# EAGLE design trinket_power_sensing_backback (EAGLE 7.7.0)
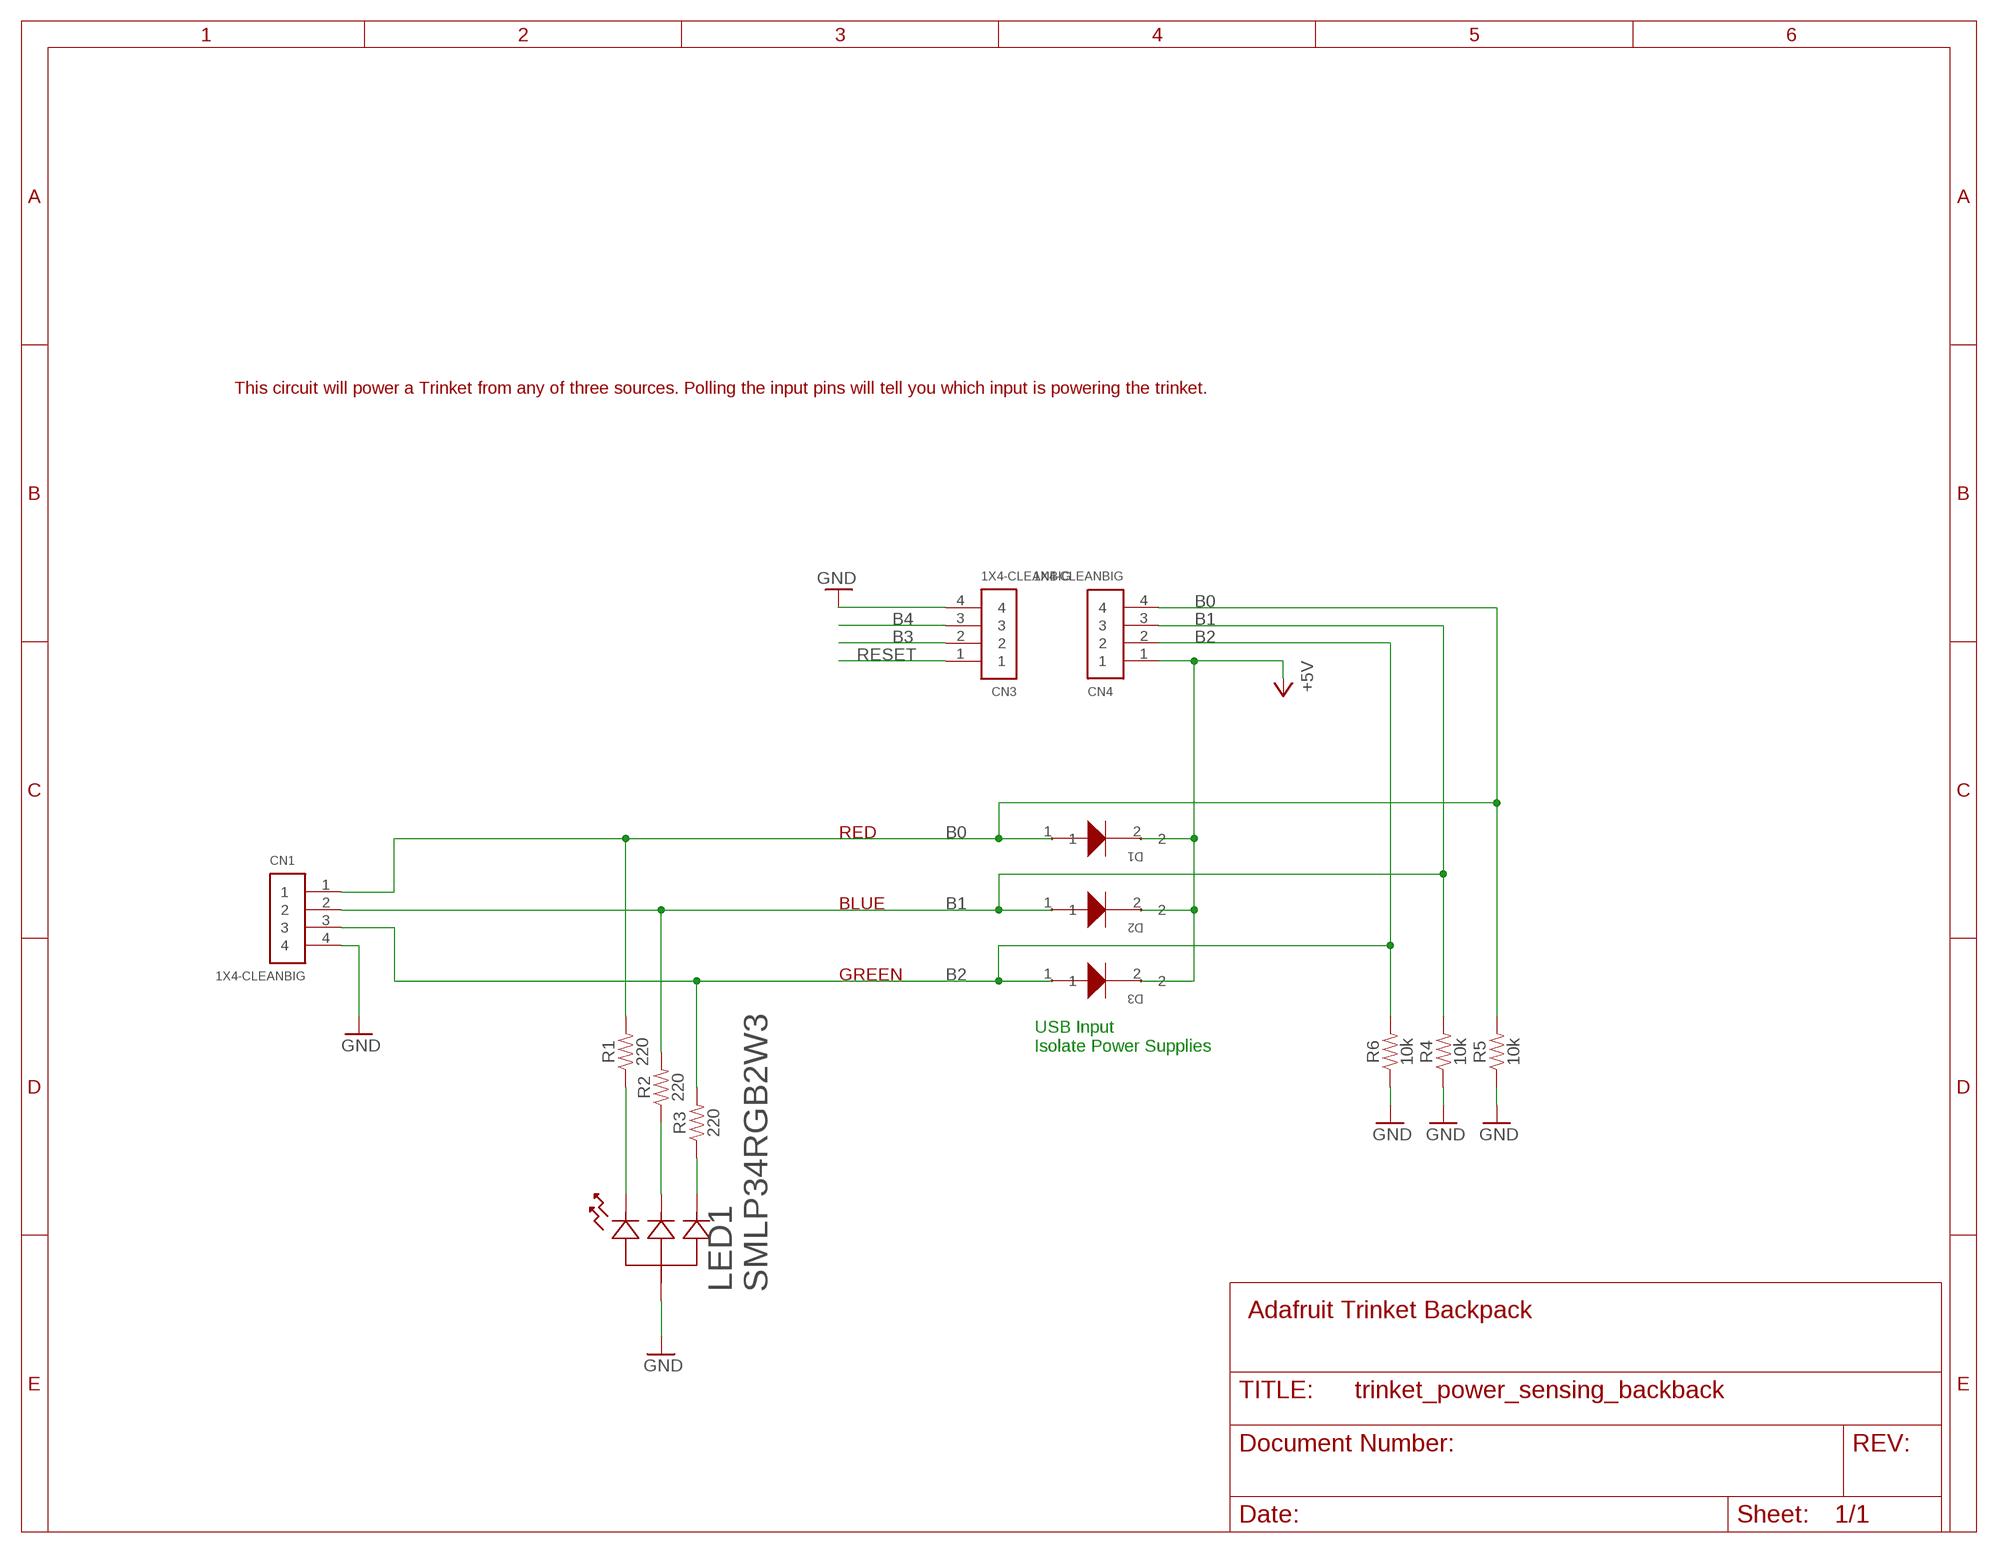
[diagram p0: schematic, sheet 1]

## Parts
CN1  1X4-CLEANBIG  [1X04-CLEANBIG]
CN3  1X4-CLEANBIG  [1X04-CLEANBIG]
CN4  1X4-CLEANBIG  [1X04-CLEANBIG]
D1  CMF04(TE12L,Q,M)  [M-FLAT_TOS]
D2  CMF04(TE12L,Q,M)  [M-FLAT_TOS]
D3  CMF04(TE12L,Q,M)  [M-FLAT_TOS]
LED1  SMLP34RGB2W3  [LED_SML-P24M_ROM]
R1  220  220OHM-0603-1/10W-1%  [0603]
R2  220  220OHM-0603-1/10W-1%  [0603]
R3  220  220OHM-0603-1/10W-1%  [0603]
R4  10k  220OHM-0603-1/10W-1%  [0603]
R5  10k  220OHM-0603-1/10W-1%  [0603]
R6  10k  220OHM-0603-1/10W-1%  [0603]

## Nets
+5V: CN4.1 D1.2 D2.2 D3.2
B0: CN1.1 CN4.4 D1.1 R1.2 R5.2
B1: CN1.2 CN4.3 D2.1 R2.2 R4.2
B2: CN1.3 CN4.2 D3.1 R3.2 R6.2
B3: CN3.2
B4: CN3.3
GND: CN1.4 CN3.4 LED1.1 R4.1 R5.1 R6.1
N$1: LED1.2 R1.1
N$2: LED1.3 R2.1
N$3: LED1.4 R3.1
RESET: CN3.1

## Notes on the sheet
- This circuit will power a Trinket from any of three sources. Polling the input pins will tell you which input is powering the trinket.
- RED
- BLUE
- GREEN
- USB Input
  Isolate Power Supplies
- Adafruit Trinket Backpack

## Library data of the parts
CN1 CN3 CN4 = adafruit:1X4: 4-pin connector
D1-D3 = CMF04(TE12L,Q):CMF04(TE12L,Q,M); BUILT_BY: EMA_UL_Team; COPYRIGHT: Copyright (C) 2018 Accelerated Designs. All rights reserved; MANUFACTURER_PART_NUMBER: CMF04(TE12L,Q,M); SOURCELIBRARY: Toshiba_2019-12-10; VENDOR: Toshiba
LED1 = SMLP34RGB2W3A:SMLP34RGB2W3; BUILT_BY: EMA_Matt; COPYRIGHT: Copyright (C) 2018 Accelerated Designs. All rights reserved; MANUFACTURER_PART_NUMBER: SMLP34RGB2W3; SOURCELIBRARY: Rohm_2019-09-23; VENDOR: ROHM Semiconductor
R1-R3 = SparkFun-Resistors:220OHM: 220Ω resistor A resistor is a passive two-terminal electrical component that implements electrical resistance as a circuit element. Resistors act to reduce current flow, and, at the same time, act to lower voltage levels within circuits. - Wikipedia; PROD_ID: RES-07861
R4-R6 = SparkFun-Resistors:220OHM: 220Ω resistor A resistor is a passive two-terminal electrical component that implements electrical resistance as a circuit element. Resistors act to reduce current flow, and, at the same time, act to lower voltage levels within circuits. - Wikipedia; PROD_ID: RES-07861; VALUE: 220

## Net classes
1 power: width 0.305 mm

## Board
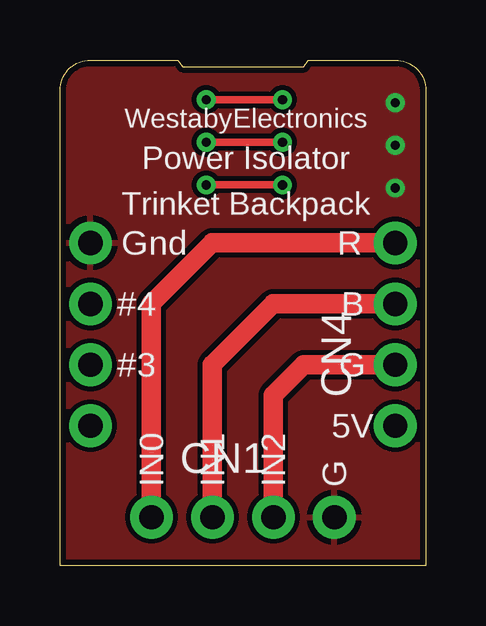
[diagram p1: board, top side]
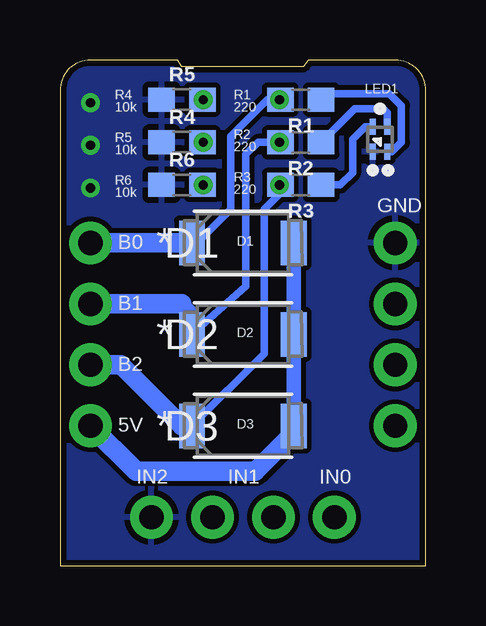
[diagram p2: board, bottom side, seen from below]

Size 15.24 x 21.08 mm. Coordinates in mm from the lower left corner, seen from the top.
Outline: 15.24,19.81 15.24,0 0,0 0,19.81 arc-90 1.27,21.08 4.9,21.08 5.11,20.8 10.16,20.8 10.34,21.08 13.97,21.08 arc-90 15.24,19.81
Copper layers (1*16): Top 0.035mm / dielectric 1.5mm / Bottom 0.035mm
Design rules "adafruit": minimum track width 8mil, minimum drill 15.5mil, track to track 8mil, track to pad 8mil, pad to pad 8mil, via to via 8mil, smd to smd 8mil, copper to edge 10mil, drill to drill 8mil, minimum pad ring 10mil, minimum via ring 8mil, stop-mask expansion 2mil, vias tented up to drill 20mil, thermal gap 10mil

### Footprints (pad centres in the part's own frame; a part is rotated, then mirrored left to right if it is on the bottom)
1X04-CLEANBIG = drill 1.016 pad 1.778: 1 -3.81,0; 2 -1.27,0; 3 1.27,0; 4 3.81,0
M-FLAT_TOS = smd 1.067 x 1.854: 1 -2.121,0; 2 2.121,0
LED_SML-P24M_ROM = smd 0.66 x 0.254: 1 -0.521,0.3; 2 -0.521,-0.3; 3 0.521,-0.3; 4 0.521,0.3
0603 = smd 1.1 x 1: 1 -0.85,0; 2 0.85,0

### Placement (x,y rotation side)
CN1  7.62,2.03 0 top
CN3  1.27,9.65 90 top
CN4  13.97,9.65 90 top
D1  7.62,13.46 0 bottom
D2  7.62,9.65 0 bottom
D3  7.62,5.84 0 bottom
LED1  1.91,17.78 90 bottom
R1  5.21,19.43 180 bottom
R2  5.21,17.65 180 bottom
R3  5.21,15.88 180 bottom
R4  10.16,17.65 0 bottom
R5  10.16,19.43 0 bottom
R6  10.16,15.88 0 bottom

### Tracks (layer width: path | path; a pad name or v marks a point on that pad's centre or on a via)
+5V
  Bottom 0.61: D1.2 D2.2 D3.2
  Bottom 0.813: 5.5,5.55 7.11,3.94 12.06,3.94 CN4.1
  Bottom 1.016: D3.2 5.5,5.55
B0  (via drill 0.38)
  Top 0.305: v6.1,19.43 v9.27,19.43
  Top 0.813: CN1.1 3.81,10.92 6.35,13.46 CN4.4
  Bottom 0.305: R5.2 v9.27,19.43 | R1.2 v6.1,19.43 6.6,19.43 8.13,17.91 8.13,14.86 9.53,13.46 D1.1
  Bottom 0.813: CN4.4 D1.1
B1  (via drill 0.38)
  Top 0.305: v9.27,17.65 v6.1,17.65
  Top 0.813: CN1.2 6.35,8.38 8.89,10.92 CN4.3
  Bottom 0.305: R4.2 v9.27,17.65 | R2.2 v6.1,17.65 6.99,17.65 7.49,17.14 7.49,11.65 D2.1
  Bottom 0.61: D2.1 9.74,10.5 10.16,10.92
  Bottom 0.813: 10.16,10.92 CN4.3
B2  (via drill 0.38)
  Top 0.305: v9.27,15.88 v6.1,15.88
  Top 0.813: CN1.3 8.89,7.11 10.16,8.38 CN4.2
  Bottom 0.305: R3.2 v6.1,15.88 6.1,15.49 6.73,14.86 6.73,8.85 D3.1 | R6.2 v9.27,15.88
  Bottom 0.813: D3.1 10.16,5.84 12.7,8.38 CN4.2
GND  (via drill 0.38)
  other vias: 13.97,17.53 13.97,19.3 13.97,15.75
  pour Bottom: -0.25,21.21 0,0 15.24,0 14.99,20.83
  pour Top: 0.25,21.21 0.25,0 15.11,0 15.11,21.21
N$1
  Bottom 0.305: LED1.2 1.41,17.26 1.02,17.65 1.02,19.18 1.52,19.69 4.1,19.69 R1.1
N$2
  Bottom 0.305: LED1.3 1.6,18.88 1.78,19.05 2.96,19.05 R2.1
N$3
  Bottom 0.305: 4.12,15.88 R3.1 3.56,15.88 3.05,16.38 3.05,17.78 2.53,18.3 LED1.4

### Text on the board
tPlace: WestabyElectronics | Power Isolator | Trinket Backpack | Gnd | R | #4 | B | #3 | G | 5V | IN0 | IN1 | IN2 | G
bPlace: LED1 | R1 | R4 | 220 | 10k | 220 | R2 | 10k | R5 | R3 | 220 | 10k | R6 | GND | D1 | B0 | B1 | D2 | B2 | D3 | 5V | IN0 | IN1 | IN2
tStop: 08_20